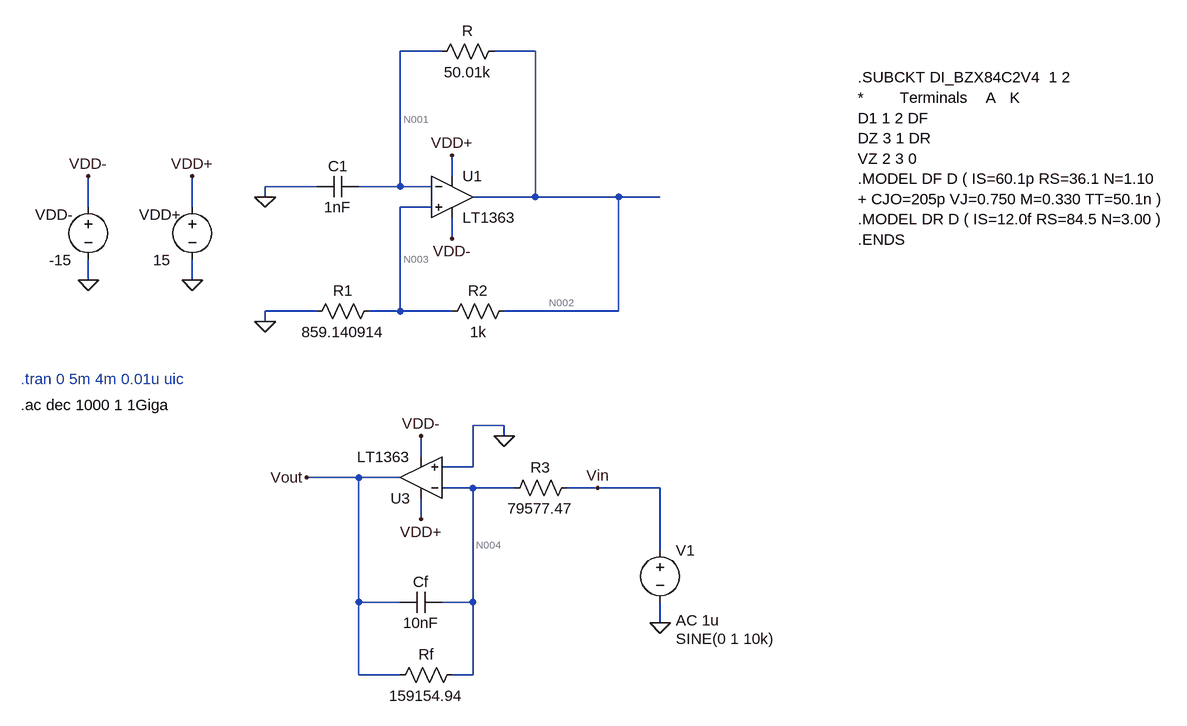
[diagram p0: schematic q3.asc]
q3.asc, the LTspice schematic file:
Version 4.1
SHEET 1 1336 1520
WIRE 176 -64 112 -64
WIRE 320 -64 256 -64
WIRE 192 128 192 96
WIRE -16 144 -96 144
WIRE 112 144 112 -64
WIRE 112 144 48 144
WIRE 160 144 112 144
WIRE -96 160 -96 144
WIRE 320 160 320 -64
WIRE 320 160 224 160
WIRE 448 160 320 160
WIRE 512 160 448 160
WIRE -368 176 -368 128
WIRE -208 176 -208 128
WIRE 160 176 112 176
WIRE 192 224 192 192
WIRE -368 288 -368 256
WIRE -208 288 -208 256
WIRE -16 336 -96 336
WIRE 112 336 112 176
WIRE 112 336 64 336
WIRE 192 336 112 336
WIRE 448 336 448 160
WIRE 448 336 272 336
WIRE -96 352 -96 336
WIRE 272 512 224 512
WIRE 272 528 272 512
WIRE 144 560 144 528
WIRE 224 576 224 512
WIRE 224 576 176 576
WIRE 48 592 -32 592
WIRE 112 592 48 592
WIRE 224 608 176 608
WIRE 288 608 224 608
WIRE 416 608 368 608
WIRE 512 608 416 608
WIRE 144 656 144 624
WIRE 512 704 512 608
WIRE 48 784 48 592
WIRE 112 784 48 784
WIRE 224 784 224 608
WIRE 224 784 176 784
WIRE 512 816 512 784
WIRE 48 896 48 784
WIRE 112 896 48 896
WIRE 224 896 224 784
WIRE 224 896 192 896
FLAG -368 288 0
FLAG -32 592 Vout
FLAG -208 288 0
FLAG -368 128 VDD-
FLAG -208 128 VDD+
FLAG 192 96 VDD+
FLAG 192 224 VDD-
FLAG -96 160 0
FLAG -96 352 0
FLAG 272 528 0
FLAG 144 656 VDD+
FLAG 144 528 VDD-
FLAG 512 816 0
FLAG 416 608 Vin
SYMBOL voltage -368 160 R0
WINDOW 0 -82 27 Left 2
WINDOW 3 -60 97 Left 2
WINDOW 123 0 0 Left 0
WINDOW 39 0 0 Left 0
SYMATTR InstName VDD-
SYMATTR Value -15
SYMBOL voltage -208 160 R0
WINDOW 0 -82 27 Left 2
WINDOW 3 -60 97 Left 2
WINDOW 123 0 0 Left 0
WINDOW 39 0 0 Left 0
SYMATTR InstName VDD+
SYMATTR Value 15
SYMBOL res 272 -80 R90
WINDOW 0 0 56 VBottom 2
WINDOW 3 32 56 VTop 2
SYMATTR InstName R
SYMATTR Value 50.01k
SYMBOL OpAmps\\LT1363 192 96 R0
SYMATTR InstName U1
SYMBOL cap 48 128 R90
WINDOW 0 0 32 VBottom 2
WINDOW 3 32 32 VTop 2
SYMATTR InstName C1
SYMATTR Value 1nF
SYMBOL res 288 320 R90
WINDOW 0 0 56 VBottom 2
WINDOW 3 32 56 VTop 2
SYMATTR InstName R2
SYMATTR Value 1k
SYMBOL res 80 320 R90
WINDOW 0 0 56 VBottom 2
WINDOW 3 32 56 VTop 2
SYMATTR InstName R1
SYMATTR Value 859.140914
SYMBOL res 384 592 R90
WINDOW 0 0 56 VBottom 2
WINDOW 3 32 56 VTop 2
SYMATTR InstName R3
SYMATTR Value 79577.47
SYMBOL OpAmps\\LT1363 144 656 R180
SYMATTR InstName U3
SYMBOL cap 176 768 R90
WINDOW 0 0 32 VBottom 2
WINDOW 3 32 32 VTop 2
SYMATTR InstName Cf
SYMATTR Value 10nF
SYMBOL res 208 880 R90
WINDOW 0 0 56 VBottom 2
WINDOW 3 32 56 VTop 2
SYMATTR InstName Rf
SYMATTR Value 159154.94
SYMBOL voltage 512 688 R0
WINDOW 3 24 152 Left 2
WINDOW 123 24 124 Left 2
WINDOW 39 0 0 Left 0
SYMATTR InstName V1
SYMATTR Value SINE(0 1 10k)
SYMATTR Value2 AC 1u
TEXT -472 440 Left 2 ;.tran 0 5m 4m 0.01u uic
TEXT -472 480 Left 2 !.ac dec 1000 1 1Giga
TEXT 816 -24 Left 2 !.SUBCKT DI_BZX84C2V4  1 2\n*        Terminals    A   K\nD1 1 2 DF\nDZ 3 1 DR\nVZ 2 3 0\n.MODEL DF D ( IS=60.1p RS=36.1 N=1.10\n+ CJO=205p VJ=0.750 M=0.330 TT=50.1n )\n.MODEL DR D ( IS=12.0f RS=84.5 N=3.00 )\n.ENDS

The netlist it stands for:
* q3.asc
VDD- VDD- 0 -15
VDD+ VDD+ 0 15
R N002 N001 50.01k
X§U1 N003 N001 VDD+ VDD- N002 LT1363  ; pins In+ In- V+ V- OUT
C1 N001 0 1nF
R2 N002 N003 1k
R1 N003 0 859.140914
R3 Vin N004 79577.47
X§U3 0 N004 VDD+ VDD- Vout LT1363  ; pins In+ In- V+ V- OUT
Cf N004 Vout 10nF
Rf N004 Vout 159154.94
V1 Vin 0 SINE(0 1 10k) AC 1u
* .tran 0 5m 4m 0.01u uic
.ac dec 1000 1 1Giga
.SUBCKT DI_BZX84C2V4  1 2
*        Terminals    A   K
D1 1 2 DF
DZ 3 1 DR
VZ 2 3 0
.MODEL DF D ( IS=60.1p RS=36.1 N=1.10
+ CJO=205p VJ=0.750 M=0.330 TT=50.1n )
.MODEL DR D ( IS=12.0f RS=84.5 N=3.00 )
.ENDS
.lib LT1363.sub
.backanno
.end

* Results of the author's LTspice run, read from the files saved beside the schematic
* Operating Point, zero values left out:
*   V(vdd+) = 15 V
*   V(n001) = 25.31 mV
*   V(n003) = 25.31 mV
*   V(n004) = -5.997 µV
*   V(vdd-) = -15 V
*   V(n002) = 55.37 mV
*   V(vout) = 95.57 mV
*   I(VDD-) = 12.59 mA
*   I(R2) = 30.06 µA
*   I(V1) = -75.36 pA
*   I(R) = 601.1 nA
*   I(R1) = 29.46 µA
*   I(R3) = 75.36 pA
*   I(Rf) = -600.5 nA
*   I(VDD+) = -12.62 mA
*   Ix(u3:1) = 600.6 nA
*   Ix(u3:2) = 600.6 nA
*   Ix(u3:3) = 6.299 mA
*   Ix(u3:4) = -6.3 mA
*   Ix(u3:5) = -600.5 nA
*   Ix(u1:1) = 601.1 nA
*   Ix(u1:2) = 601.1 nA
*   Ix(u1:3) = 6.317 mA
*   Ix(u1:4) = -6.287 mA
*   Ix(u1:5) = -30.66 µA
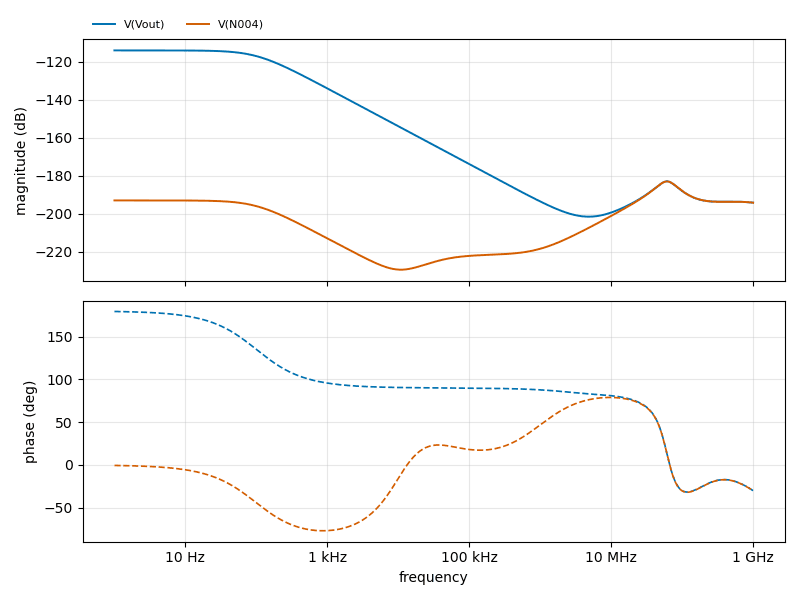
[diagram p1: AC Analysis of q3.asc, plotted from the saved traces]
* AC Analysis, 1 run:
*   V(Vout): -113.98 dB at 1 Hz, -194.26 dB at 1 GHz, peak -113.98 dB at 1 Hz, 3 dB below the peak at 100 Hz
*   V(N004): -193.07 dB at 1 Hz, -194.26 dB at 1 GHz, peak -183.05 dB at 61.24 MHz, 3 dB below the peak at 43.69 MHz and 85.34 MHz